# Altium schematic sheet 主控4.SchDoc
size A3
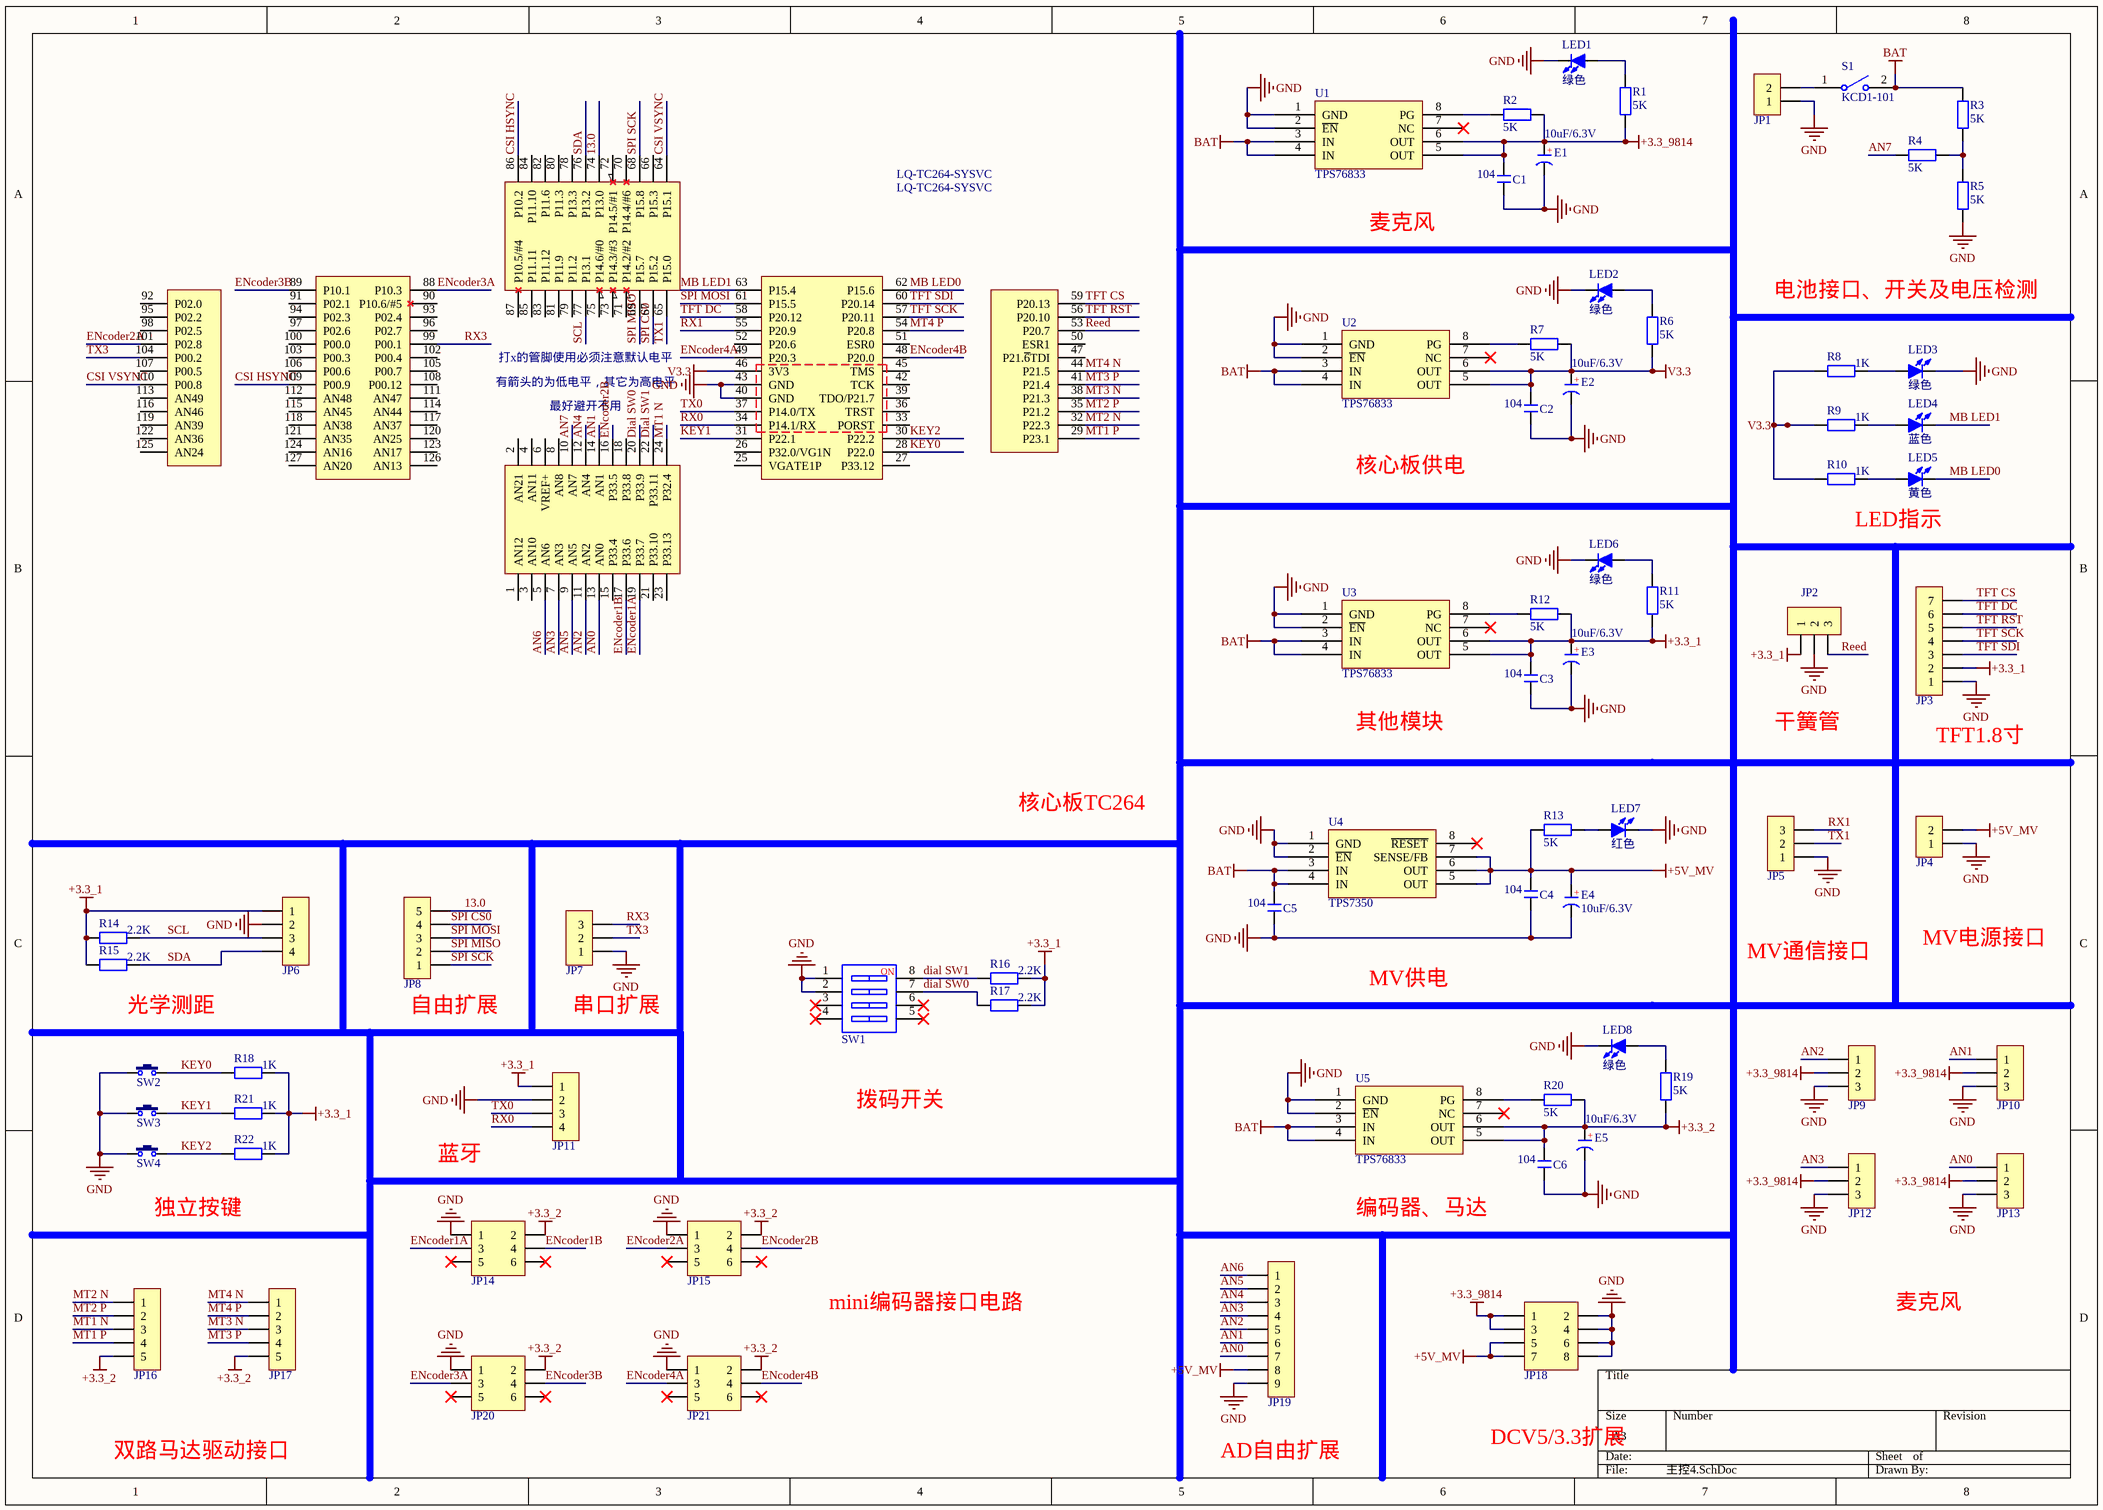
[diagram p0: 主控4.SchDoc]

## Parts
C1  104  [C 0805_M]
C2  104  [C 0805_M]
C3  104  [C 0805_M]
C4  104  [C 0805_M]
C5  104  [C 0805_M]
C6  104  [C 0805_M]
E1  10uF/6.3V  [CD A(3216)]
E2  10uF/6.3V  [CD A(3216)]
E3  10uF/6.3V  [CD A(3216)]
E4  10uF/6.3V  [CD A(3216)]
E5  10uF/6.3V  [CD A(3216)]
JP1  HDR-1X2  [KF128-5.08-2P]  (value not drawn)
JP2  HDR-1X3  [XH2.54-LI-3P]  (value not drawn)
JP3  HDR-1X7  [HDR2.54-M-LI-7P]  (value not drawn)
JP4  HDR-1X2  [XH2.54-LI-2P]  (value not drawn)
JP5  HDR-1X3  [XH2.54-LI-3P]  (value not drawn)
JP6  HDR-1X4  [XH2.54-LI-4P]  (value not drawn)
JP7  HDR-1X3  [XH2.54-LI-3P]  (value not drawn)
JP8  HDR-1X5  [HDR2.54-LI-5P]  (value not drawn)
JP9  HDR-1X3  [XH2.54-LI-3P]  (value not drawn)
JP10  HDR-1X3  [XH2.54-LI-3P]  (value not drawn)
JP11  HDR-1X4  [HDR2.54-M-LI-4P]  (value not drawn)
JP12  HDR-1X3  [XH2.54-LI-3P]  (value not drawn)
JP13  HDR-1X3  [XH2.54-LI-3P]  (value not drawn)
JP14  Header3X2  [HDR2.54-LI-2x3P]  (value not drawn)
JP15  Header3X2  [HDR2.54-LI-2x3P]  (value not drawn)
JP16  HDR-1X5  [XH2.54-LI-5P]  (value not drawn)
JP17  HDR-1X5  [XH2.54-LI-5P]  (value not drawn)
JP18  Header 4X2  [HDR2.54-LI-2x4P]  (value not drawn)
JP19  HDR-1X9  [HDR2.54-LI-9P]  (value not drawn)
JP20  Header3X2  [HDR2.54-LI-2x3P]  (value not drawn)
JP21  Header3X2  [HDR2.54-LI-2x3P]  (value not drawn)
LED1  绿色  [LED 0805R]
LED2  绿色  [LED 0805R]
LED3  绿色  [LED 0805R]
LED4  蓝色  [LED 0805R]
LED5  黄色  [LED 0805R]
LED6  绿色  [LED 0805R]
LED7  红色  [LED 0805R]
LED8  绿色  [LED 0805R]
LQ-TC264-SYSVC  LQ-TC264-SYSVC  [LQ-TC264-SYSVC-S]
R1  5K  [R 0805-HP_M]
R2  5K  [R 0805-HP_M]
R3  5K  [R 0805-HP_M]
R4  5K  [R 0805-HP_M]
R5  5K  [R 0805-HP_M]
R6  5K  [R 0805-HP_M]
R7  5K  [R 0805-HP_M]
R8  1K  [R 0805-HP_M]
R9  1K  [R 0805-HP_M]
R10  1K  [R 0805-HP_M]
R11  5K  [R 0805-HP_M]
R12  5K  [R 0805-HP_M]
R13  5K  [R 0805-HP_M]
R14  2.2K  [R 0805-HP_M]
R15  2.2K  [R 0805-HP_M]
R16  2.2K  [R 0805-HP_M]
R17  2.2K  [R 0805-HP_M]
R18  1K  [R 0805-HP_M]
R19  5K  [R 0805-HP_M]
R20  5K  [R 0805-HP_M]
R21  1K  [R 0805-HP_M]
R22  1K  [R 0805-HP_M]
S1  KCD1-101  [KCD1-101]
SW1  CSW-4P  [CSW DIP-4P]  (value not drawn)
SW2  3x6x5  [TSW SMD-3*6*2.5]  (value not drawn)
SW3  3x6x5  [TSW SMD-3*6*2.5]  (value not drawn)
SW4  3x6x5  [TSW SMD-3*6*2.5]  (value not drawn)
U1  TPS76833  [SOP8]
U2  TPS76833  [SOP8]
U3  TPS76833  [SOP8]
U4  TPS7350  [SOP8]
U5  TPS76833  [SOP8]

## Nets
+3.3_1: C3.2 E3.1(A) JP2.1 JP3.2 JP6.1 JP11.1 R11.1 R12.2 R14.1 R15.1 R16.2 R17.2 R18.2 R21.2 R22.2 U3.5(OUT) U3.6(OUT)
+3.3_2: C6.2 E5.1(A) JP14.2 JP15.2 JP16.5 JP17.5 JP20.2 JP21.2 R19.1 R20.2 U5.5(OUT) U5.6(OUT)
+3.3_9814: C1.2 E1.1(A) JP9.2 JP10.2 JP12.2 JP13.2 JP18.1 JP18.3 R1.1 R2.2 U1.5(OUT) U1.6(OUT)
+5V_MV: C4.2 E4.1(A) JP4.2 JP18.5 JP18.7 JP19.8 R13.1 U4.5(OUT) U4.6(OUT) U4.7(SENSE/FB)
BAT: C5.2 R3.2 S1.2 U1.3(IN) U1.4(IN) U2.3(IN) U2.4(IN) U3.3(IN) U3.4(IN) U4.3(IN) U4.4(IN) U5.3(IN) U5.4(IN)
GND: C1.1 C2.1 C3.1 C4.1 C5.1 C6.1 E1.2(K) E2.2(K) E3.2(K) E4.2(K) E5.2(K) JP1.1 JP2.2 JP3.1 JP4.1 JP5.1 JP6.2 JP7.1 JP9.3 JP10.3 JP11.2 JP12.3 JP13.3 JP14.1 JP15.1 JP18.2 JP18.4 JP18.6 JP18.8 JP19.9 JP20.1 JP21.1 LED1.2(K) LED2.2(K) LED3.2(K) LED6.2(K) LED7.2(K) LED8.2(K) LQ-TC264-SYSVC.40(GND) LQ-TC264-SYSVC.43(GND) R5.1 SW1.1 SW1.2 SW2.1 SW3.1 SW4.1 U1.1(GND) U1.2(~{EN}) U2.1(GND) U2.2(~{EN}) U3.1(GND) U3.2(~{EN}) U4.1(GND) U4.2(~{EN}) U5.1(GND) U5.2(~{EN})
V3.3: C2.2 E2.1(A) LQ-TC264-SYSVC.46(3V3) R6.1 R7.2 R8.1 R9.1 R10.1 U2.5(OUT) U2.6(OUT)
13.0: JP8.5 LQ-TC264-SYSVC.74(P13.0)
AN0: JP13.1 JP19.7 LQ-TC264-SYSVC.13(AN0)
AN1: JP10.1 JP19.6 LQ-TC264-SYSVC.14(AN1)
AN2: JP9.1 JP19.5 LQ-TC264-SYSVC.11(AN2)
AN3: JP12.1 JP19.4 LQ-TC264-SYSVC.7(AN3)
AN4: JP19.3 LQ-TC264-SYSVC.12(AN4)
AN5: JP19.2 LQ-TC264-SYSVC.9(AN5)
AN6: JP19.1 LQ-TC264-SYSVC.5(AN6)
AN7: LQ-TC264-SYSVC.10(AN7) R4.2
CSI HSYNC: LQ-TC264-SYSVC.86(P10.2) LQ-TC264-SYSVC.109(P00.9)
CSI VSYNC: LQ-TC264-SYSVC.64(P15.1) LQ-TC264-SYSVC.110(P00.8)
dial SW0: LQ-TC264-SYSVC.20(P33.9) R17.1 SW1.7
dial SW1: LQ-TC264-SYSVC.22(P33.11) R16.1 SW1.8
ENcoder1A: JP14.3 LQ-TC264-SYSVC.19(P33.7)
ENcoder1B: JP14.4 LQ-TC264-SYSVC.17(P33.6)
ENcoder2A: JP15.3 LQ-TC264-SYSVC.101(P02.8)
ENcoder2B: JP15.4 LQ-TC264-SYSVC.16(P33.5)
ENcoder3A: JP20.3 LQ-TC264-SYSVC.88(P10.3)
ENcoder3B: JP20.4 LQ-TC264-SYSVC.89(P10.1)
ENcoder4A: JP21.3 LQ-TC264-SYSVC.49(P20.3)
ENcoder4B: JP21.4 LQ-TC264-SYSVC.48(P20.0)
KEY0: LQ-TC264-SYSVC.28(P22.0) R18.1 SW2.2
KEY1: LQ-TC264-SYSVC.31(P22.1) R21.1 SW3.2
KEY2: LQ-TC264-SYSVC.30(P22.2) R22.1 SW4.2
MB LED0: LED5.2(K) LQ-TC264-SYSVC.62(P15.6)
MB LED1: LED4.2(K) LQ-TC264-SYSVC.63(P15.4)
MT1 N: JP16.3 LQ-TC264-SYSVC.24(P32.4)
MT1 P: JP16.4 LQ-TC264-SYSVC.29(P23.1)
MT2 N: JP16.1 LQ-TC264-SYSVC.32(P22.3)
MT2 P: JP16.2 LQ-TC264-SYSVC.35(P21.2)
MT3 N: JP17.3 LQ-TC264-SYSVC.38(P21.3)
MT3 P: JP17.4 LQ-TC264-SYSVC.41(P21.4)
MT4 N: JP17.1 LQ-TC264-SYSVC.44(P21.5)
MT4 P: JP17.2 LQ-TC264-SYSVC.54(P20.8)
Reed: JP2.3 LQ-TC264-SYSVC.53(P20.7)
RX0: JP11.4 LQ-TC264-SYSVC.34(P14.1/RX)
RX1: JP5.3 LQ-TC264-SYSVC.55(P20.9)
RX3: JP7.3 LQ-TC264-SYSVC.99(P00.1)
SCL: JP6.3 LQ-TC264-SYSVC.77(P13.1) R14.2
SDA: JP6.4 LQ-TC264-SYSVC.76(P13.2) R15.2
SPI CS0: JP8.4 LQ-TC264-SYSVC.67(P15.2)
SPI MISO: JP8.2 LQ-TC264-SYSVC.69(P15.7)
SPI MOSI: JP8.3 LQ-TC264-SYSVC.61(P15.5)
SPI SCK: JP8.1 LQ-TC264-SYSVC.68(P15.8)
TFT CS: JP3.7 LQ-TC264-SYSVC.59(P20.13)
TFT DC: JP3.6 LQ-TC264-SYSVC.58(P20.12)
TFT RST: JP3.5 LQ-TC264-SYSVC.56(P20.10)
TFT SCK: JP3.4 LQ-TC264-SYSVC.57(P20.11)
TFT SDI: JP3.3 LQ-TC264-SYSVC.60(P20.14)
TX0: JP11.3 LQ-TC264-SYSVC.37(P14.0/TX)
TX1: JP5.2 LQ-TC264-SYSVC.65(P15.0)
TX3: JP7.2 LQ-TC264-SYSVC.104(P00.2)
NetJP1_2: JP1.2 S1.1
NetLED1_1: LED1.1(A) R1.2
NetLED2_1: LED2.1(A) R6.2
NetLED3_1: LED3.1(A) R8.2
NetLED4_1: LED4.1(A) R9.2
NetLED5_1: LED5.1(A) R10.2
NetLED6_1: LED6.1(A) R11.2
NetLED7_1: LED7.1(A) R13.2
NetLED8_1: LED8.1(A) R19.2
NetR2_1: R2.1 U1.8(PG)
NetR3_1: R3.1 R4.1 R5.2
NetR7_1: R7.1 U2.8(PG)
NetR12_1: R12.1 U3.8(PG)
NetR20_1: R20.1 U5.8(PG)

Not connected (* = marked no-connect by the designer): JP14 5* 6*; JP15 5* 6*; JP20 5* 6*; JP21 5* 6*; LQ-TC264-SYSVC 1(AN12) 2(AN21) 3(AN10) 4(AN11) 6(VREF+) 8(AN8) 15(P33.4) 18(P33.8) 21(P33.10) 23(P33.13) 25(VGATE1P) 26(P32.0/VG1N) 27(P33.12) 33(PORST) 36(TRST) 39(TDO/P21.7) 42(TCK) 45(TMS) 47(P21.~{6}TDI) 50(ESR1) 51(ESR0) 52(P20.6) 66(P15.3) 70(P14.4/#6) 71(P14.2/#2) 72(P14.5/#1) 73(P14.3/#3) 75(P14.6/#0) 78(P13.3) 79(P11.2) 80(P11.3) 81(P11.9) 82(P11.6) 83(P11.12) 84(P11.10) 85(P11.11) 87(P10.5/#4) 90(P10.6/#5) 91(P02.1) 92(P02.0) 93(P02.4) 94(P02.3) 95(P02.2) 96(P02.7) 97(P02.6) 98(P02.5) 100(P00.0) 102(P00.4) 103(P00.3) 105(P00.7) 106(P00.6) 107(P00.5) 108(P00.12) 111(AN47) 112(AN48) 113(AN49) 114(AN44) 115(AN45) 116(AN46) 117(AN37) 118(AN38) 119(AN39) 120(AN25) 121(AN35) 122(AN36) 123(AN17) 124(AN16) 125(AN24) 126(AN13) 127(AN20); SW1 3* 4* 5* 6*; U1 7(NC)*; U2 7(NC)*; U3 7(NC)*; U4 8(~{RESET})*; U5 7(NC)*

## Notes on the sheet
- 麦克风
- 电池接口、开关及电压检测
- 核心板供电
- LED指示
- 其他模块
- 干簧管
- (near JP3) TFT1.8寸
- 核心板TC264
- MV供电
- MV通信接口
- MV电源接口
- (near R15) 光学测距
- (near JP8) 自由扩展
- (near JP7) 串口扩展
- 拨码开关
- 蓝牙
- 独立按键
- 编码器、马达
- mini编码器接口电路
- 双路马达驱动接口
- AD自由扩展
- DCV5/3.3扩展
- (in symbol C-CD) +
- (in symbol CSW-4P) NO
- (in symbol LQ-TC264-SYSVC) 打x的管脚使用必须注意默认电平; 有箭头的为低电平，其它为高电平; 最好避开不用

## Library data of the parts
C1-C6 = C: 无极性贴片电容; 版权归属: 源创客; BOM名称: 无极性贴片电容; 学习资源: www.ooocke.com
E1-E5 = C-CD: 贴片钽电容; 版权归属: 源创客; BOM名称: 贴片钽电容; 学习资源: www.ooocke.com
JP1 JP4 = Header 2: 2P接插件; 版权归属: 源创客; BOM名称: 2P接插件; 学习资源: www.ooocke.com
JP2 JP5 JP7 JP9 JP10 JP12 JP13 = Header 3: 3P接插件; 版权归属: 源创客; BOM名称: 3P接插件; 学习资源: www.ooocke.com
JP3 = Header 7: 7P接插件; 版权归属: 源创客; BOM名称: 7P接插件; 学习资源: www.ooocke.com
JP6 JP11 = Header 4: 4P接插件; 版权归属: 源创客; BOM名称: 4P接插件; 学习资源: www.ooocke.com
JP8 JP16 JP17 = Header 5: 5P接插件; 版权归属: 源创客; BOM名称: 5P接插件; 学习资源: www.ooocke.com
JP14 JP15 JP20 JP21 = Header 3X2: 3*2P接插件; 版权归属: 源创客; BOM名称: 3*2P接插件; 学习资源: www.ooocke.com
JP18 = Header 4X2: 4*2P接插件; 版权归属: 源创客; BOM名称: 4*2P接插件; 学习资源: www.ooocke.com
JP19 = Header 9: 9P接插件; 版权归属: 源创客; BOM名称: 9P接插件; 学习资源: www.ooocke.com
LED1-LED8 = LED-SMD: 贴片LED; 版权归属: 源创客; BOM名称: 贴片LED; 学习资源: www.ooocke.com
R1-R22 = R-Precision: 精密贴片电阻; BOM名称: 精密电阻; 版权归属: 源创客; 学习资源: www.ooocke.com
S1 = KCD1-101: 1路单刀船型开关; 版权归属: 源创客; BOM名称: 1路单刀船型开关; 学习资源: www.ooocke.com
SW1 = CSW-4P: 4路编码开关; 版权归属: 源创客; BOM名称: 4路编码开关; 学习资源: www.ooocke.com
SW2-SW4 = TSW 3x6: 3x6轻触开关; 版权归属: 源创客; BOM名称: 3x6轻触开关; 学习资源: www.ooocke.com
U4 = TPS7350: 稳压